# Altium schematic sheet Sheet2.SchDoc
size A
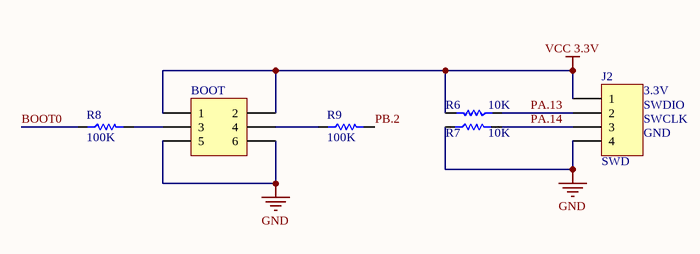
[diagram p0: Sheet2.SchDoc]

## Parts
BOOT  Header 3X2  [HDR2X3]  (value not drawn)
J2  SWD  [HDR1X4]
R6  10K  [SMD_RES_0805]
R7  10K  [SMD_RES_0805]
R8  100K  [SMD_RES_0805]
R9  100K  [SMD_RES_0805]

## Nets
GND: BOOT.5 BOOT.6 J2.4 R7.1
VCC 3.3V: BOOT.1 BOOT.2 J2.1 R6.2
BOOT0: R8.1
PA.13: J2.2 R6.1
PA.14: J2.3 R7.2
PB.2: R9.2
NetBOOT_3: BOOT.3 R8.2
NetBOOT_4: BOOT.4 R9.1

## Notes on the sheet
- (near J2) 3.3V
- (near J2) SWDIO
- (near J2) SWCLK
- (near J2) GND

## Library data of the parts
BOOT = Header 3X2: Header, 3-Pin, Dual row; LatestRevisionDate: 17-Jul-2002; LatestRevisionNote: Re-released for DXP Platform.; Publisher: Altium Limited
J2 = Header 4: Header, 4-Pin; LatestRevisionDate: 17-Jul-2002; LatestRevisionNote: Re-released for DXP Platform.; Publisher: Altium Limited
R6-R9 = Resistor: Tolerance: 5%; Power: 1/8 W
  R6 R7: Value: 10K
  R8 R9: Value: 100K